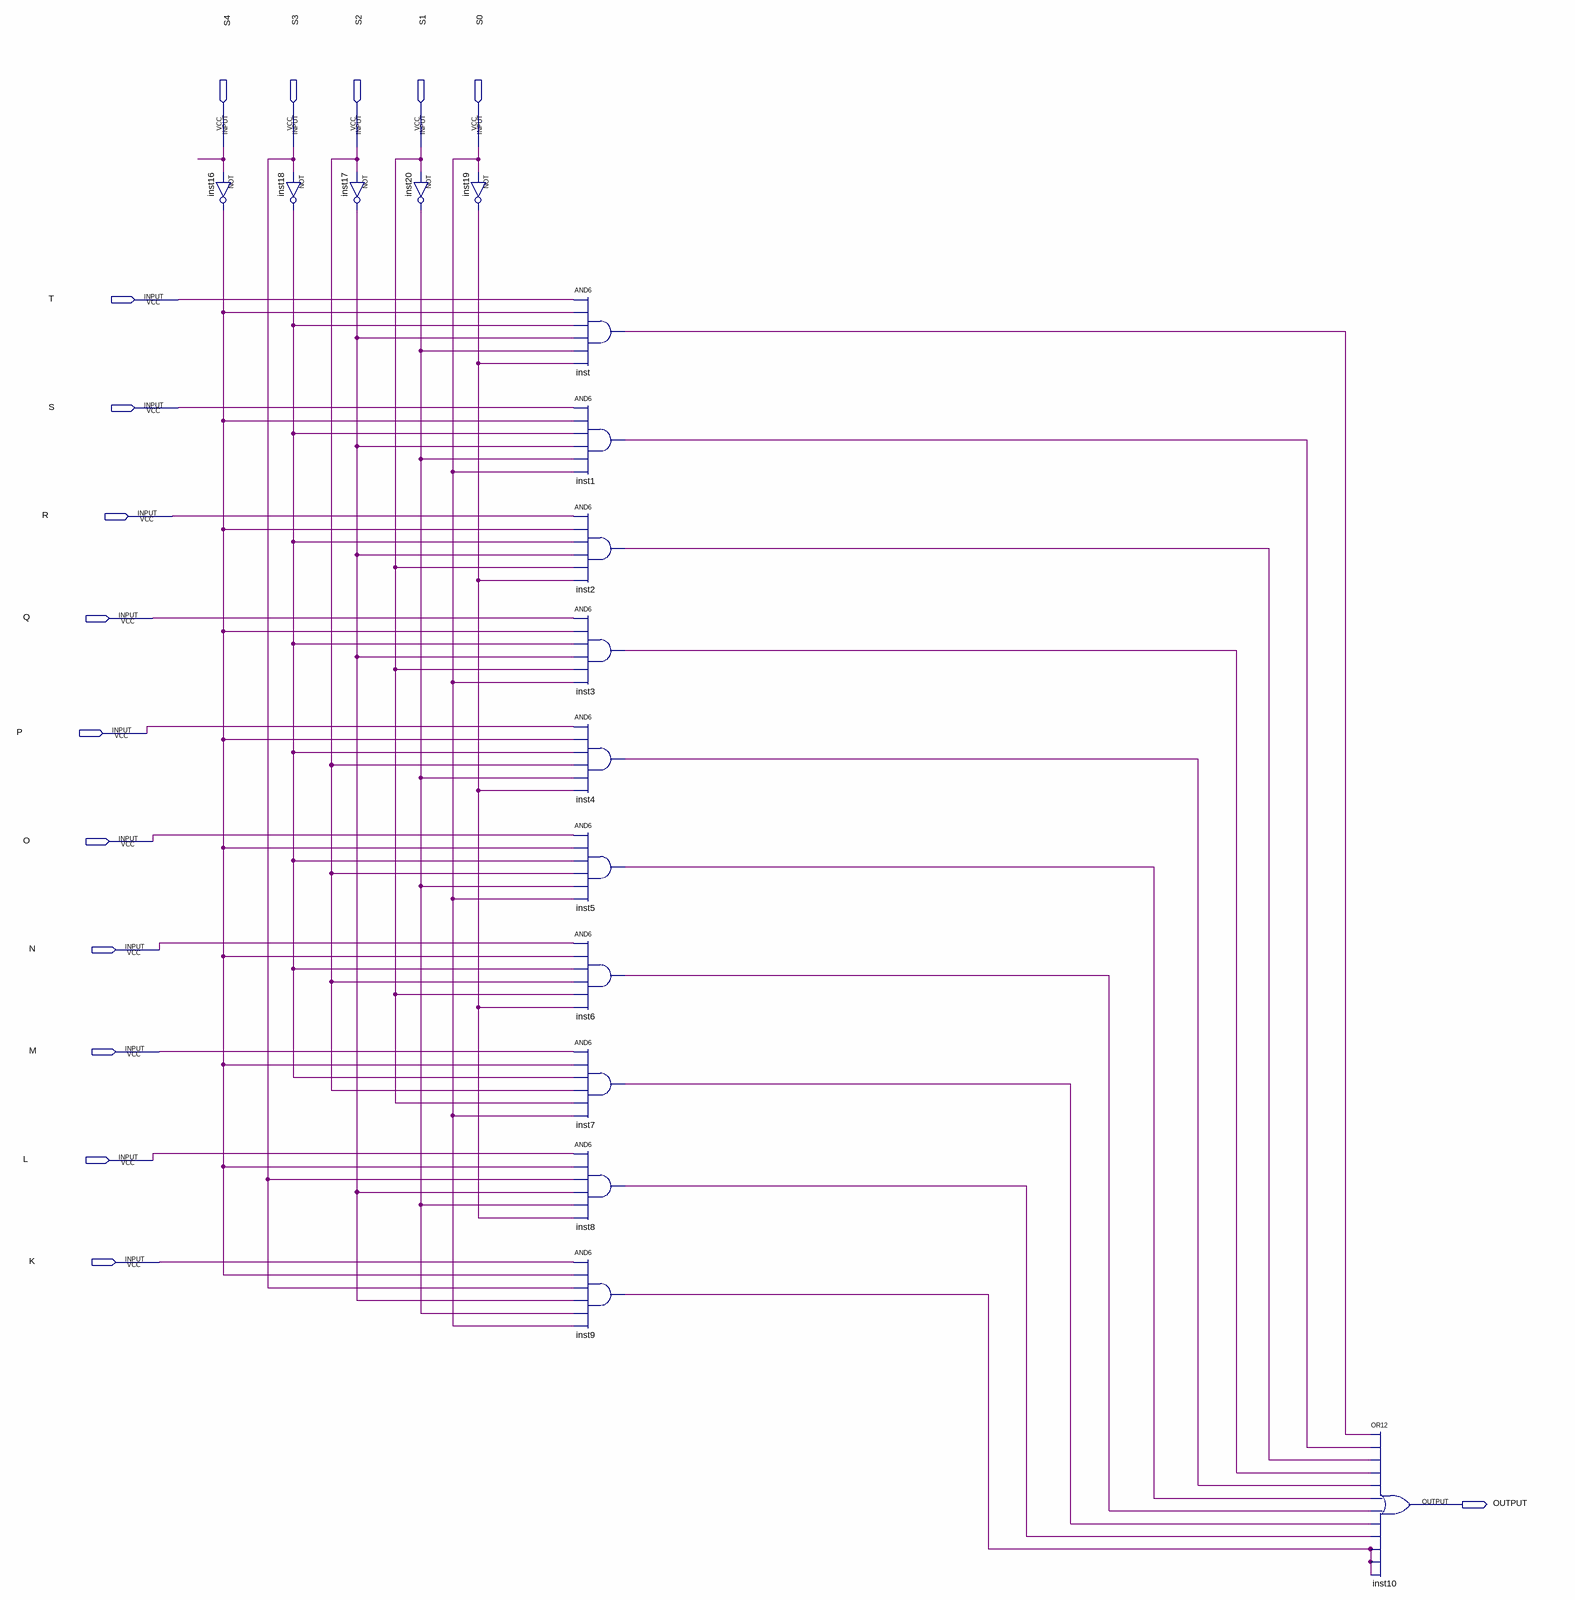
[diagram p0: schematic sheet]
// Quartus schematic mux10to1.bdf as structural Verilog: 16 symbols, 16 pins
module mux10to1 (
  input  S4,
  input  S3,
  input  S2,
  input  S1,
  input  S0,
  input  T,
  input  S,
  input  R,
  input  Q,
  input  P,
  input  O,
  input  N,
  input  M,
  input  L,
  input  K,
  output OUTPUT
);

  wire inst1_out, inst2_out, inst3_out, inst4_out, inst5_out, inst6_out, inst7_out, inst8_out, inst9_out,
       inst16_out, inst17_out, inst18_out, inst19_out, inst20_out, inst_out;

  not inst16 (inst16_out, S4);
  not inst18 (inst18_out, S3);
  not inst17 (inst17_out, S2);
  not inst20 (inst20_out, S1);
  not inst19 (inst19_out, S0);
  and inst (inst_out, T, inst16_out, inst18_out, inst17_out, inst20_out, inst19_out);
  and inst1 (inst1_out, S, inst16_out, inst18_out, inst17_out, inst20_out, S0);
  and inst2 (inst2_out, R, inst16_out, inst18_out, inst17_out, S1, inst19_out);
  and inst3 (inst3_out, Q, inst16_out, inst18_out, inst17_out, S1, S0);
  and inst4 (inst4_out, P, inst16_out, inst18_out, S2, inst20_out, inst19_out);
  and inst5 (inst5_out, O, inst16_out, inst18_out, S2, inst20_out, S0);
  and inst6 (inst6_out, N, inst16_out, inst18_out, S2, S1, inst19_out);
  and inst7 (inst7_out, M, inst16_out, inst18_out, S2, S1, S0);
  and inst8 (inst8_out, L, inst16_out, S3, inst17_out, inst20_out, inst19_out);
  and inst9 (inst9_out, K, inst16_out, S3, inst17_out, inst20_out, S0);
  or inst10 (OUTPUT, inst_out, inst1_out, inst2_out, inst3_out, inst4_out, inst5_out, inst6_out, inst7_out, inst8_out, inst9_out, inst9_out, inst9_out);
endmodule
